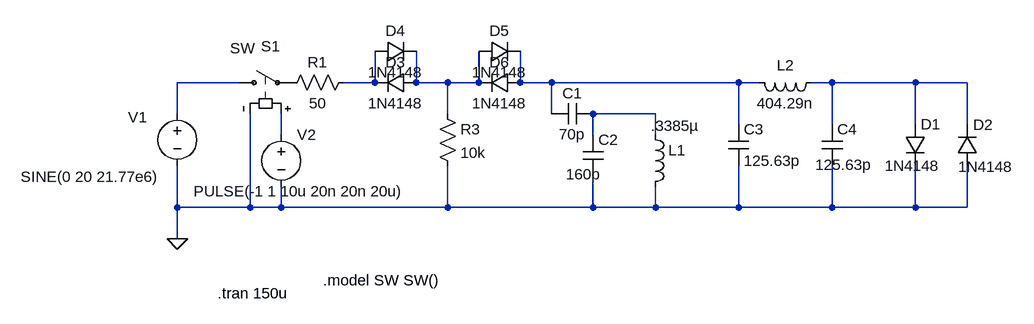
[diagram p0: schematic ProbeFilter.asc]
ProbeFilter.asc, the LTspice schematic file:
Version 4
SHEET 1 968 680
WIRE -336 80 -432 80
WIRE -128 80 -128 32
WIRE -128 80 -176 80
WIRE -64 80 -64 32
WIRE -16 80 -64 80
WIRE 32 80 32 32
WIRE 32 80 -16 80
WIRE 96 80 96 32
WIRE 144 80 96 80
WIRE 432 80 144 80
WIRE 464 80 432 80
WIRE 576 80 544 80
WIRE 704 80 576 80
WIRE 784 80 704 80
WIRE -432 128 -432 80
WIRE -16 128 -16 80
WIRE 144 128 144 80
WIRE 304 128 208 128
WIRE 432 144 432 80
WIRE 576 144 576 80
WIRE 704 144 704 80
WIRE 784 144 784 80
WIRE -272 160 -272 128
WIRE 208 160 208 128
WIRE 304 160 304 128
WIRE -432 272 -432 208
WIRE -320 272 -320 128
WIRE -320 272 -432 272
WIRE -272 272 -272 240
WIRE -272 272 -320 272
WIRE -16 272 -16 208
WIRE -16 272 -272 272
WIRE 208 272 208 224
WIRE 208 272 -16 272
WIRE 304 272 304 240
WIRE 304 272 208 272
WIRE 432 272 432 208
WIRE 432 272 304 272
WIRE 576 272 576 208
WIRE 576 272 432 272
WIRE 704 272 704 208
WIRE 704 272 576 272
WIRE 784 272 784 208
WIRE 784 272 704 272
WIRE -432 320 -432 272
FLAG -432 320 0
SYMBOL voltage -432 112 R0
WINDOW 0 -76 21 Left 2
WINDOW 3 -241 113 Left 2
WINDOW 123 0 0 Left 0
WINDOW 39 0 0 Left 0
SYMATTR InstName V1
SYMATTR Value SINE(0 20 21.77e6)
SYMBOL sw -352 80 R270
WINDOW 0 56 49 VRight 2
WINDOW 3 53 1 VRight 2
SYMATTR InstName S1
SYMBOL voltage -272 144 R0
WINDOW 3 -135 103 Left 2
WINDOW 123 0 0 Left 0
WINDOW 39 0 0 Left 0
SYMATTR InstName V2
SYMATTR Value PULSE(-1 1 10u 20n 20n 20u)
SYMBOL cap 208 112 R90
WINDOW 0 0 32 VBottom 2
WINDOW 3 32 32 VTop 2
SYMATTR InstName C1
SYMATTR Value 70p
SYMBOL ind 288 144 R0
WINDOW 3 9 2 Left 2
SYMATTR InstName L1
SYMATTR Value .3385µ
SYMBOL cap 192 160 R0
WINDOW 3 -26 61 Left 2
SYMATTR InstName C2
SYMATTR Value 160p
SYMBOL diode 688 144 R0
WINDOW 3 -31 64 Left 2
SYMATTR InstName D1
SYMATTR Value 1N4148
SYMBOL diode 800 208 R180
WINDOW 0 -24 63 Left 2
WINDOW 3 -55 -1 Left 2
SYMATTR InstName D2
SYMATTR Value 1N4148
SYMBOL res -160 64 R90
WINDOW 0 0 56 VBottom 2
WINDOW 3 32 56 VTop 2
SYMATTR InstName R1
SYMATTR Value 50
SYMBOL ind 560 64 R90
WINDOW 0 5 56 VBottom 2
WINDOW 3 32 56 VTop 2
SYMATTR InstName L2
SYMATTR Value 404.29n
SYMBOL cap 416 144 R0
SYMATTR InstName C3
SYMATTR Value 125.63p
SYMBOL cap 560 144 R0
WINDOW 3 -10 62 Left 2
SYMATTR InstName C4
SYMATTR Value 125.63p
SYMBOL diode -64 64 R90
WINDOW 0 0 32 VBottom 2
WINDOW 3 32 32 VTop 2
SYMATTR InstName D3
SYMATTR Value 1N4148
SYMBOL diode -128 48 R270
WINDOW 0 32 32 VTop 2
WINDOW 3 0 32 VBottom 2
SYMATTR InstName D4
SYMATTR Value 1N4148
SYMBOL diode 32 48 R270
WINDOW 0 32 32 VTop 2
WINDOW 3 0 32 VBottom 2
SYMATTR InstName D5
SYMATTR Value 1N4148
SYMBOL diode 96 64 R90
WINDOW 0 0 32 VBottom 2
WINDOW 3 32 32 VTop 2
SYMATTR InstName D6
SYMATTR Value 1N4148
SYMBOL res -32 112 R0
SYMATTR InstName R3
SYMATTR Value 10k
TEXT -208 384 Left 2 !.model SW SW()
TEXT -370 404 Left 2 !.tran 150u

The netlist it stands for:
* ProbeFilter.asc
V1 N001 0 SINE(0 20 21.77e6)
S1 N001 P001 N007 0 SW
V2 N007 0 PULSE(-1 1 10u 20n 20n 20u)
C1 N006 N004 70p
L1 N006 0 .3385µ
C2 N006 0 160p
D1 N005 0 1N4148
D2 0 N005 1N4148
R1 N002 P001 50
L2 N005 N004 404.29n
C3 N004 0 125.63p
C4 N005 0 125.63p
D3 N003 N002 1N4148
D4 N002 N003 1N4148
D5 N003 N004 1N4148
D6 N004 N003 1N4148
R3 N003 0 10k
.model D D
.lib standard.dio
.model SW SW()
.tran 150u
.backanno
.end